# EAGLE schematic LabDuinoBt (EAGLE 7.2.0)
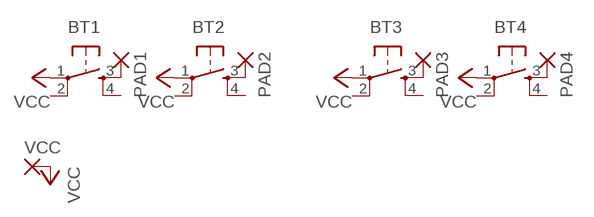
[diagram p0: schematic, sheet 1]

## Parts
BT1  TAC_SWITCHPTH  [TACTILE-PTH]
BT2  TAC_SWITCHPTH  [TACTILE-PTH]
BT3  TAC_SWITCHPTH  [TACTILE-PTH]
BT4  TAC_SWITCHPTH  [TACTILE-PTH]
PAD1  1,6/0,9  [1,6/0,9]
PAD2  1,6/0,9  [1,6/0,9]
PAD3  1,6/0,9  [1,6/0,9]
PAD4  1,6/0,9  [1,6/0,9]
VCC  1,6/0,9  [1,6/0,9]

## Nets
N$1: BT1.3 PAD1.1(P)
N$2: BT2.3 PAD2.1(P)
N$3: BT3.3 PAD3.1(P)
N$4: BT4.3 PAD4.1(P)
VCC: BT1.1 BT2.1 BT3.1 BT4.1 VCC.1(P)
Unconnected: BT1.2 BT1.4 BT2.2 BT2.4 BT3.2 BT3.4 BT4.2 BT4.4

## Library data of the parts
BT1-BT4 = SparkFun-Retired:TAC_SWITCH: Momentary Switch Button commonly used for reset or general input. Spark Fun Electronics SKU : COM-00097 SMT- SWCH-08247
PAD1-PAD4 VCC = wirepad:1,6/0,9: THROUGH-HOLE PAD

## Net classes
0 default: width 1.5 mm, drill 0.508 mm, clearance 2 mm